# Altium schematic sheet SCH4_Main_Computer_USB.SchDoc: Main Computer - USB 3.0
size B; Organization: CWRUbotix; Address1: 10900 Euclid Avenue; Address2: Cleveland, OH 44106; Address3: USA; Revision: 1.0; SheetNumber: 4; SheetTotal: 13
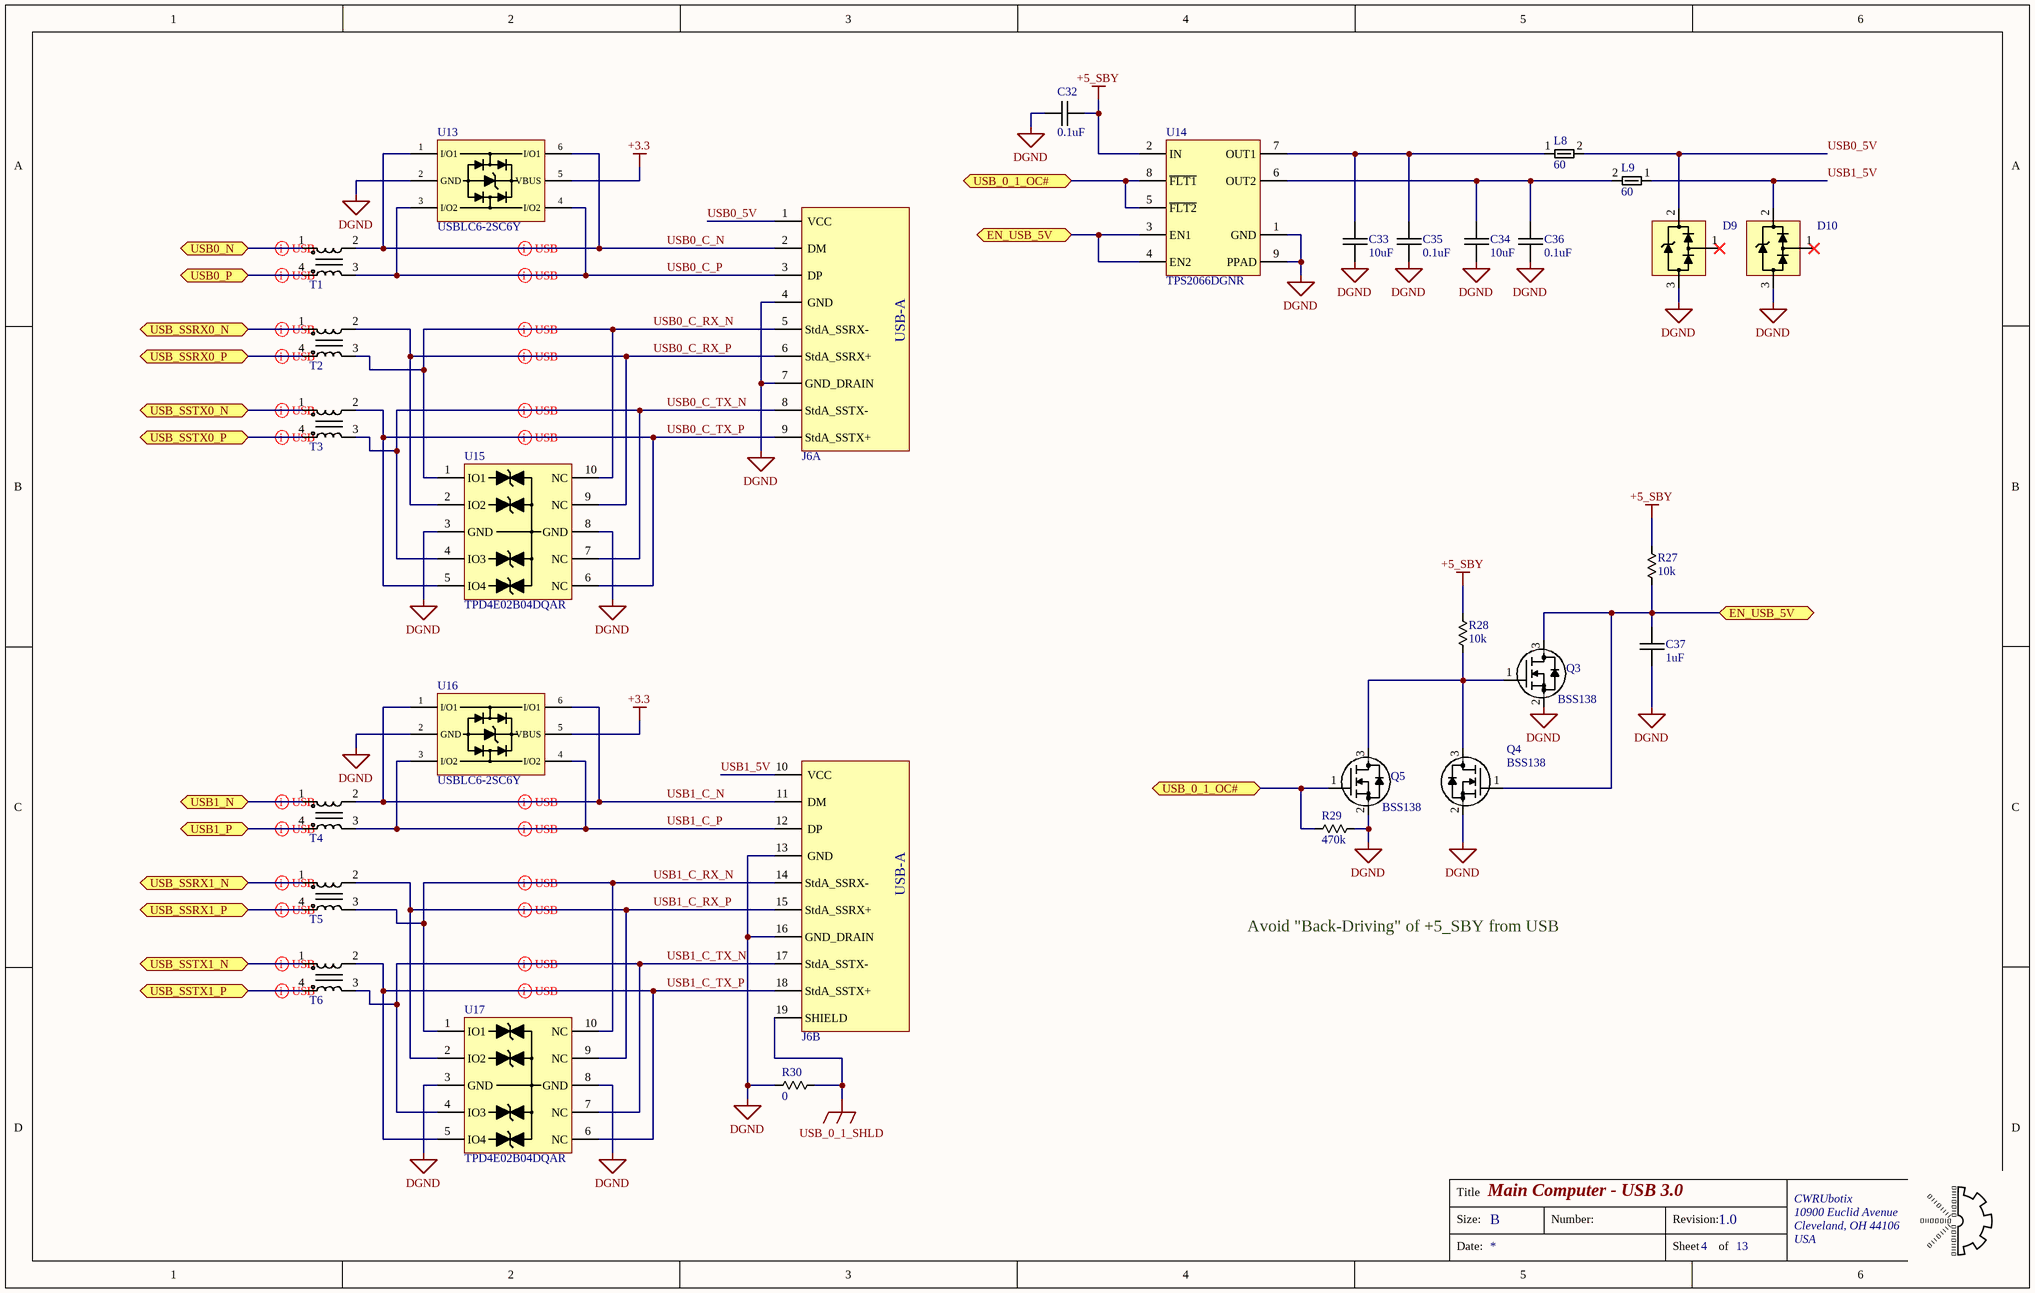
[diagram p0: SCH4_Main_Computer_USB.SchDoc]

## Parts
C32  0.1uF  [chip_0603]
C33  10uF  [chip_1206]
C34  10uF  [chip_1206]
C35  0.1uF  [chip_0603]
C36  0.1uF  [chip_0603]
C37  1uF  [chip_0805]
D9  DLPT05  [sot-23-3]  (value not drawn)
D10  DLPT05  [sot-23-3]  (value not drawn)
J6  1003-004-01010  [CNC_TECH_1003-004-01010]  (value not drawn)  (parts A,B of 2)
L8  Impedance: 60  [CHIP_0805_FE]  (hidden comment: bead_0)
L9  Impedance: 60  [CHIP_0805_FE]  (hidden comment: bead_0)
Q3  Manufacturer PN: BSS138  [sot-23-3]  (hidden comment: n-mosfet_1)
Q4  Manufacturer PN: BSS138  [sot-23-3]  (hidden comment: n-mosfet_1)
Q5  Manufacturer PN: BSS138  [sot-23-3]  (hidden comment: n-mosfet_1)
R27  10k  [chip_0603]
R28  10k  [chip_0603]
R29  470k  [chip_0603]
R30  0  [chip_0805]
T1  DLW21HN900SQ2L  [MURATA_DLW21H]  (value not drawn)
T2  DLW21HN900SQ2L  [MURATA_DLW21H]  (value not drawn)
T3  DLW21HN900SQ2L  [MURATA_DLW21H]  (value not drawn)
T4  DLW21HN900SQ2L  [MURATA_DLW21H]  (value not drawn)
T5  DLW21HN900SQ2L  [MURATA_DLW21H]  (value not drawn)
T6  DLW21HN900SQ2L  [MURATA_DLW21H]  (value not drawn)
U13  USBLC6-2SC6Y  [sot-23-6]
U14  TPS2066DGNR  [VSSOP-8-PPAD]
U15  TPD4E02B04DQAR  [USON-10]
U16  USBLC6-2SC6Y  [sot-23-6]
U17  TPD4E02B04DQAR  [USON-10]

## Ports
EN_USB_5V (bidir), USB0_N (bidir), USB0_P (bidir), USB1_N (bidir), USB1_P (bidir), USB_0_1_OC# (bidir), USB_SSRX0_N (bidir), USB_SSRX0_P (bidir), USB_SSRX1_N (bidir), USB_SSRX1_P (bidir), USB_SSTX0_N (bidir), USB_SSTX0_P (bidir), USB_SSTX1_N (bidir), USB_SSTX1_P (bidir)

## Nets
+3.3: U13.5(VBUS) U16.5(VBUS)
+5_SBY: C32.2 R27.1 R28.1 U14.2(IN)
DGND: C32.1 C33.2 C34.2 C35.1 C36.1 C37.2 D9.3(GND) D10.3(GND) J6.4(GND) J6.7(GND_DRAIN) J6.13(GND) J6.16(GND_DRAIN) Q3.2(S) Q4.2(S) Q5.2(S) R29.2 R30.1 U13.2(GND) U14.1(GND) U14.9(PPAD) U15.3(GND) U15.8(GND) U16.2(GND) U17.3(GND) U17.8(GND)
USB_0_1_SHLD: J6.19(SHIELD) R30.2
EN_USB_5V: C37.1 Q3.3(D) Q4.1(G) R27.2 U14.3(EN1) U14.4(EN2) ; port EN_USB_5V
USB0_5V: D9.2(VCC) J6.1(VCC) L8.2
USB0_C_N: J6.2(DM) T1.2 U13.1(I/O1) U13.6(I/O1)
USB0_C_P: J6.3(DP) T1.3 U13.3(I/O2) U13.4(I/O2)
USB0_C_RX_N: J6.5(StdA_SSRX-) T2.3 U15.1(IO1) U15.10(NC)
USB0_C_RX_P: J6.6(StdA_SSRX+) T2.2 U15.2(IO2) U15.9(NC)
USB0_C_TX_N: J6.8(StdA_SSTX-) T3.3 U15.4(IO3) U15.7(NC)
USB0_C_TX_P: J6.9(StdA_SSTX+) T3.2 U15.5(IO4) U15.6(NC)
USB0_N: T1.1 ; port USB0_N
USB0_P: T1.4 ; port USB0_P
USB1_5V: D10.2(VCC) J6.10(VCC) L9.1
USB1_C_N: J6.11(DM) T4.2 U16.1(I/O1) U16.6(I/O1)
USB1_C_P: J6.12(DP) T4.3 U16.3(I/O2) U16.4(I/O2)
USB1_C_RX_N: J6.14(StdA_SSRX-) T5.3 U17.1(IO1) U17.10(NC)
USB1_C_RX_P: J6.15(StdA_SSRX+) T5.2 U17.2(IO2) U17.9(NC)
USB1_C_TX_N: J6.17(StdA_SSTX-) T6.3 U17.4(IO3) U17.7(NC)
USB1_C_TX_P: J6.18(StdA_SSTX+) T6.2 U17.5(IO4) U17.6(NC)
USB1_N: T4.1 ; port USB1_N
USB1_P: T4.4 ; port USB1_P
USB_0_1_OC#: Q5.1(G) R29.1 U14.5(~{FLT2}) U14.8(~{FLT1}) ; port USB_0_1_OC#
USB_SSRX0_N: T2.1 ; port USB_SSRX0_N
USB_SSRX0_P: T2.4 ; port USB_SSRX0_P
USB_SSRX1_N: T5.1 ; port USB_SSRX1_N
USB_SSRX1_P: T5.4 ; port USB_SSRX1_P
USB_SSTX0_N: T3.1 ; port USB_SSTX0_N
USB_SSTX0_P: T3.4 ; port USB_SSTX0_P
USB_SSTX1_N: T6.1 ; port USB_SSTX1_N
USB_SSTX1_P: T6.4 ; port USB_SSTX1_P
NetC33_1: C33.1 C35.2 L8.1 U14.7(OUT1)
NetC34_1: C34.1 C36.2 L9.2 U14.6(OUT2)
NetQ3_1: Q3.1(G) Q4.3(D) Q5.3(D) R28.2

Not connected (* = marked no-connect by the designer): D9 1(LINE)*; D10 1(LINE)*

## Layout directives
differential pair: USB0_C_N, USB0_C_P, USB0_C_RX_N, USB0_C_RX_P, USB0_C_TX_N, USB0_C_TX_P, USB0_N, USB0_P, USB1_C_N, USB1_C_P, USB1_C_RX_N, USB1_C_RX_P, USB1_C_TX_N, USB1_C_TX_P, USB1_N, USB1_P, USB_SSRX0_N, USB_SSRX0_P, USB_SSRX1_N, USB_SSRX1_P, USB_SSTX0_N, USB_SSTX0_P, USB_SSTX1_N, USB_SSTX1_P

## Notes on the sheet
- Avoid "Back-Driving" of +5_SBY from USB
- Title
- Size:
- B
- Number:
- Revision:
- Date:
- Sheet
- of
- (in symbol CONN-00079, part A) USB-A
- (in symbol CONN-00079, part B) USB-A

## Library data of the parts
C32 C35 C36 = CAP-00542: CAP, 0.1uF, ±10%, 16V, X7R, 0603; Manufacturer: Murata; Part Number: CAP-00542; Capacitance: 0.1uF; Tolerance: ±10%; Voltage Rating: 16V; Type: X7R
C33 C34 = CAP-00539: CAP, 10uF, ±10%, 25V, X7R, 1206; Manufacturer: Samsung; Manufacturer PN: CL31B106KAHNNNE; Part Number: CAP-00539; Capacitance: 10uF; Tolerance: ±10%; Voltage Rating: 25V; Type: X7R
C37 = CAP-00110: CAP, 1uF, 10%, 16V, X7R, 0805; Manufacturer: Murata; Manufacturer PN: GRM21BR71C105KA01K; Part Number: CAP-00110; Capacitance: 1uF; Tolerance: 10%; Voltage Rating: 16V; Type: X7R
D9 D10 = DIO-00057: TVS, Steering (Rail-Rail), 9.8V Clamping, 17A Peak Pulse, SOT-23; Manufacturer: Diodes Incorporated; Manufacturer PN: DLPT05-7-F; Reverse Breakdown Voltage: 6.0V; Part Number: DIO-00057; Type: TVS; Cost: 0.38
J6 = CONN-00079: USB-A Jack x2, USB 3.0, Right-Angle, Thru-Hole; Manufacturer: CNC Tech; Positions per level: 9; Levels: 2; Part Number: CONN-00079; Type: Jack; Manufacturer PN: 1003-004-01010; Cost: 3.55
L8 L9 = MAG-00125: Fe Bead, 60 @ 100MH, 3A, 0805; Manufacturer: Pulse Electronics; Manufacturer PN: PE-0805PFB600ST; Test Freq: 100MHz; DCR: 25mOhm; Part Number: MAG-00125; Current Rating: 3A; Cost: 0.1
Q3-Q5 = XSTR-00017: XSTR NMOS, 220mA, 50V, Vgs 1.3V, SOT-23-3; Manufacturer: ON Semi; Max Power: 360mW; Type: NFET; Part Number: XSTR-00017; Max Voltage: 50V; Max Current: 220mA; Vgs/Vce: 1.3V; Cost: 0.31
R27 R28 = RES-00306: RES SMD 10K OHM 1% 1/4W 0603; Manufacturer: Panasonic; Manufacturer PN: ERJ-PA3F1002V; Power Rating: 0.25W; Part Number: RES-00306; Resistance: 10k; Tolerance: 1%; Cost: 0.144
R29 = RES-00489: RES SMD 470K OHM 1% 1/4W 0603; Manufacturer: Panasonic; Manufacturer PN: ERJ-PA3F4703V; Power Rating: 0.25W; Part Number: RES-00489; Resistance: 470k; Tolerance: 1%
R30 = RES-00720: RES SMD 0 OHM 1/8W 0805 Thick Film; Manufacturer: Stackpole; Manufacturer PN: RMCF0805ZT0R00; Tolerance: Jumper; Part Number: RES-00720; Resistance: 0; Power Rating: 1/8W; Cost: 0.1
T1-T6 = MAG-00121: CMC, 330mA 2-CH 90 OHM @ 100MHz SMD; Manufacturer: Murata; Impedance: 90; DCR: 350mOhm; Part Number: MAG-00121; Test Freq: 100MHz; Manufacturer PN: DLW21HN900SQ2L; Cost: 0.53
U13 U16 = DIO-00069: ESD Protec, 2-Ch, 2.5pF, 17V clamping voltage, SOT23-6; Manufacturer: ST; Forward Voltage: 1.1V; Reverse Breakdown Voltage: 6V; Current Rating: 5A; Part Number: DIO-00069; Type: TVS; Manufacturer PN: USBLC6-2SC6Y; Cost: 0.73
U14 = PWREG-00052: IC, Power Switch 1:2, 8-MSOP; Manufacturer: TI; Voltage Range In: 2.7 ~ 5.5V; Max Current: 1A; Part Number: PWREG-00052; Voltage Range Out: 2.7 ~ 5.5V; Reg Type: Power Switch; Manufacturer PN: TPS2066DGNR; Cost: 1.56
U15 U17 = DIO-00068: TVS, 4-Ch, ESD Protec, 3.6V 8.8V 10-USON; Manufacturer: TI; Power Rating: 17W; Current Rating: 2A; Part Number: DIO-00068; Type: TVS; Manufacturer PN: TPD4E02B04DQAR; Cost: 0.56